# Altium schematic sheet MCU.SchDoc
size A4
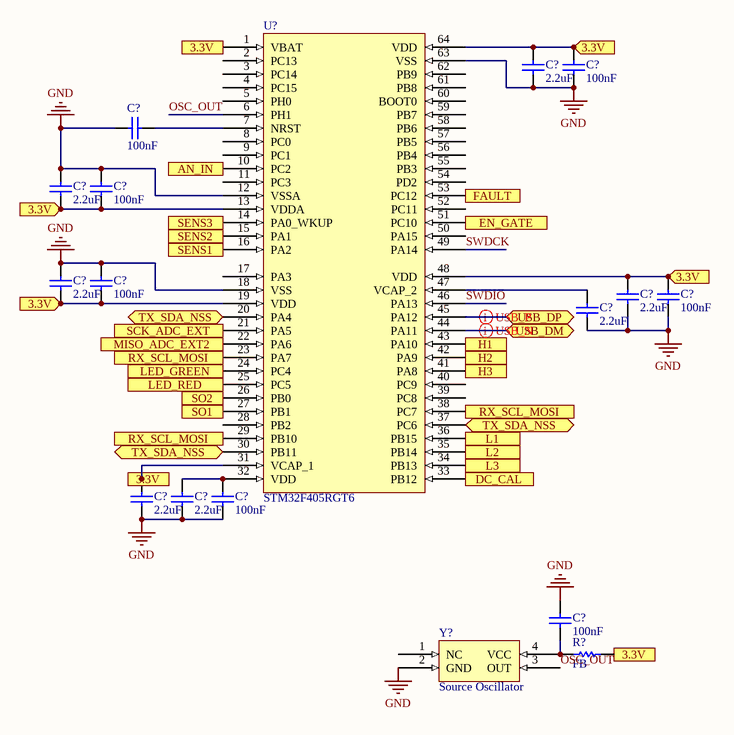
[diagram p0: MCU.SchDoc]

## Parts
(Parts that share a designator on the sheet are numbered #1, #2 ... from top to bottom, then left to right.)
C?#1  2.2uF  [SMC_0805]
C?#2  100nF  [SMC_0805]
C?#3  100nF  [SMC_0805]
C?#4  2.2uF  [SMC_0805]
C?#5  100nF  [SMC_0805]
C?#6  2.2uF  [SMC_0805]
C?#7  100nF  [SMC_0805]
C?#8  2.2uF  [SMC_0805]
C?#9  100nF  [SMC_0805]
C?#10  2.2uF  [SMC_0805]
C?#11  2.2uF  [SMC_0805]
C?#12  2.2uF  [SMC_0805]
C?#13  100nF  [SMC_0805]
C?#14  100nF  [SMC_0805]
R?  FB  [SMR_0805]
U?  STM32F405RGT6  [TSQFP50P1200X1200X160-64N]
Y?  Source Oscillator  [SMD_5032]

## Ports
3.3V (in), AN_IN (in), DC_CAL (in), EN_GATE (out), FAULT (in), H1 (out), H2 (out), H3 (out), L1 (out), L2 (out), L3 (out), LED_GREEN (out), LED_RED (out), MISO_ADC_EXT2 (in), RX_SCL_MOSI (in), RX_SCL_MOSI (out), SCK_ADC_EXT (in), SENS1 (in), SENS2 (in), SENS3 (in), SO1 (in), SO2 (in), TX_SDA_NSS (bidir), USB_DM (bidir), USB_DP (bidir)

## Nets
GND: C?#1.1 C?#2.1 C?#3.1 C?#4.2 C?#5.2 C?#6.2 C?#7.2 C?#8.1 C?#9.1 C?#10.1 C?#11.1 C?#12.1 C?#13.1 C?#14.2 U?.12(VSSA) U?.18(VSS) U?.63(VSS) Y?.2(GND)
3.3V: C?#1.2 C?#2.2 C?#4.1 C?#5.1 C?#6.1 C?#7.1 C?#8.2 C?#9.2 R?.2 U?.1(VBAT) U?.13(VDDA) U?.19(VDD) U?.48(VDD) U?.64(VDD) ; port 3.3V
AN_IN: U?.10(PC2) ; port AN_IN
DC_CAL: U?.33(PB12) ; port DC_CAL
EN_GATE: U?.51(PC10) ; port EN_GATE
FAULT: U?.53(PC12) ; port FAULT
H1: U?.43(PA10) ; port H1
H2: U?.42(PA9) ; port H2
H3: U?.41(PA8) ; port H3
L1: U?.36(PB15) ; port L1
L2: U?.35(PB14) ; port L2
L3: U?.34(PB13) ; port L3
LED_GREEN: U?.24(PC4) ; port LED_GREEN
LED_RED: U?.25(PC5) ; port LED_RED
MISO_ADC_EXT2: U?.22(PA6) ; port MISO_ADC_EXT2
OSC_OUT: U?.6(PH1) Y?.3(OUT)
RX_SCL_MOSI: U?.23(PA7) U?.29(PB10) U?.38(PC7) ; port RX_SCL_MOSI
SCK_ADC_EXT: U?.21(PA5) ; port SCK_ADC_EXT
SENS1: U?.16(PA2) ; port SENS1
SENS2: U?.15(PA1) ; port SENS2
SENS3: U?.14(PA0_WKUP) ; port SENS3
SO1: U?.27(PB1) ; port SO1
SO2: U?.26(PB0) ; port SO2
SWDCK: U?.49(PA14)
SWDIO: U?.46(PA13)
TX_SDA_NSS: U?.20(PA4) U?.30(PB11) U?.37(PC6) ; port TX_SDA_NSS
USB_DM: U?.44(PA11) ; port USB_DM
USB_DP: U?.45(PA12) ; port USB_DP
NetC?#3_2: C?#3.2 U?.7(NRST)
NetC?#10_2: C?#10.2 U?.47(VCAP_2)
NetC?#11_2: C?#11.2 U?.31(VCAP_1)
NetC?#12_2: C?#12.2 C?#13.2 U?.32(VDD)
NetC?#14_1: C?#14.1 R?.1 Y?.4(VCC)

Not connected (* = marked no-connect by the designer): U? 2(PC13) 3(PC14) 4(PC15) 5(PH0) 8(PC0) 9(PC1) 11(PC3) 17(PA3) 28(PB2) 39(PC8) 40(PC9) 50(PA15) 52(PC11) 54(PD2) 55(PB3) 56(PB4) 57(PB5) 58(PB6) 59(PB7) 60(BOOT0) 61(PB8) 62(PB9); Y? 1(NC)

## Layout directives
differential pair: USB_DM, USB_DP

## Library data of the parts
C?#1-C?#14 = Cap Ceramic
R? = Res SMT